# Altium schematic sheet Battery.SchDoc: Battery
size A4; Date: 2016/01/04; Author: Samuel López; DocumentNumber: 3; SheetNumber: 3; SheetTotal: 7; Project: H2H Main Board
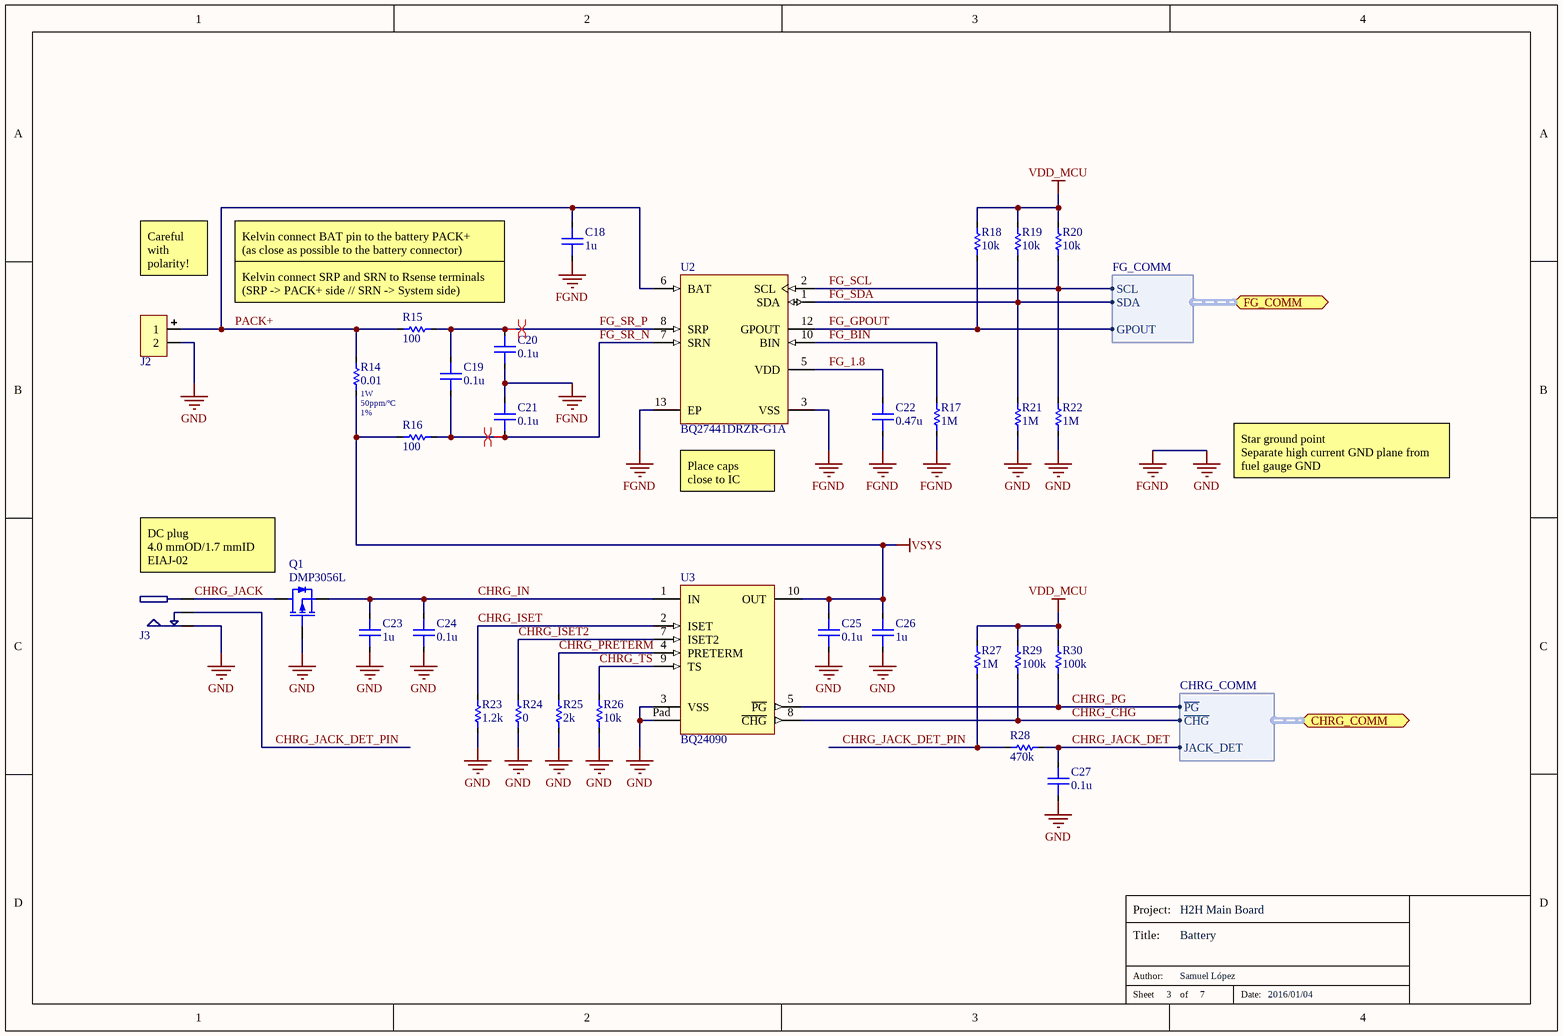
[diagram p0: Battery.SchDoc]

## Parts
C18  1u  [C0603]
C19  0.1u  [C0603]
C20  0.1u  [C0603]
C21  0.1u  [C0603]
C22  0.47u  [C0603]
C23  1u  [C0603]
C24  0.1u  [C0603]
C25  0.1u  [C0603]
C26  1u  [C0603]
C27  0.1u  [C0603]
J2  JST PH 2 Pin  [S2B-PH-K-S]  (value not drawn)
J3  PJ-018H-SMT  [PJ-018H-SMT]  (value not drawn)
Q1  DMP3056L  [DMP3056L]
R14  0.01  Power: 1W  Tolerance: 1%  Temp. coef.: 50ppm/ºC  [R1206]
R15  100  [R0603]
R16  100  [R0603]
R17  1M  [R0603]
R18  10k  [R0603]
R19  10k  [R0603]
R20  10k  [R0603]
R21  1M  [R0603]
R22  1M  [R0603]
R23  1.2k  [R0603]
R24  0  [R0603]
R25  2k  [R0603]
R26  10k  [R0603]
R27  1M  [R0603]
R28  470k  [R0603]
R29  100k  [R0603]
R30  100k  [R0603]
U2  BQ27441DRZR-G1A  [BQ27441DRZx-G1A]
U3  BQ24090  [BQ24090]

## Ports
CHRG_COMM (harness CHRG_COMM), FG_COMM (harness FG_COMM)

## Harnesses
FG_COMM: SCL, SDA, GPOUT
CHRG_COMM: ~{PG}, ~{CHG}, JACK_DET

## Nets
FGND: C18.1 C20.1 C21.2 C22.1 C23.1 C24.1 C25.1 C26.1 C27.1 J2.2 J3.2 Q1.1(G) R17.2 R21.2 R22.2 R23.2 R24.2 R25.2 R26.2 U2.3(VSS) U2.13(EP) U3.3(VSS) U3.Pad(Thermal)  [also labelled GND]
VDD_MCU: R18.1 R19.1 R20.1 R27.1 R29.1 R30.1
VSYS: C25.2 C26.2 R14.2 R16.1 U3.10(OUT)
CHRG_CHG: R29.2 U3.8(~{CHG}) ; port CHRG_COMM.~{CHG}
CHRG_IN: C23.2 C24.2 Q1.2(S) U3.1(IN)
CHRG_ISET: R23.1 U3.2(ISET)
CHRG_ISET2: R24.1 U3.7(ISET2)
CHRG_JACK: J3.1 Q1.3(D)
CHRG_JACK_DET: C27.2 R28.1 ; port CHRG_COMM.JACK_DET
CHRG_JACK_DET_PIN: J3.3 R27.2 R28.2
CHRG_PG: R30.2 U3.5(~{PG}) ; port CHRG_COMM.~{PG}
CHRG_PRETERM: R25.1 U3.4(PRETERM)
CHRG_TS: R26.1 U3.9(TS)
FG_1.8: C22.2 U2.5(VDD)
FG_BIN: R17.1 U2.10(BIN)
FG_GPOUT: R18.2 U2.12(GPOUT) ; port FG_COMM.GPOUT
FG_SCL: R20.2 R22.1 U2.2(SCL) ; port FG_COMM.SCL
FG_SDA: R19.2 R21.1 U2.1(SDA) ; port FG_COMM.SDA
FG_SR_N: C19.1 C21.1 R16.2 U2.7(SRN)
FG_SR_P: C19.2 C20.2 R15.2 U2.8(SRP)
PACK+: C18.2 J2.1 R14.1 R15.1 U2.6(BAT)

## Layout directives
differential pair: FG_SR_N, FG_SR_P

## Notes on the sheet
- Careful with
  polarity!
- Kelvin connect BAT pin to the battery PACK+
  (as close as possible to the battery connector)
- Kelvin connect SRP and SRN to Rsense terminals
  (SRP -> PACK+ side // SRN -> System side)
- (near U2) Place caps
  close to IC
- Star ground point
  Separate high current GND plane from
  fuel gauge GND
- DC plug
  4.0 mmOD/1.7 mmID
  EIAJ-02
- Project:
- Title:
- Sheet
- Author:
- of
- Date:

## Library data of the parts
C18-C27 = Capacitor: Rated Voltage: *
  C18 C23 C26: Value: 1u
  C19-C21 C24 C25 C27: Value: 0.1u
  C22: Value: 0.47u
J2 = S2B-PH-K-S: Conn - Battery, Male, 2 Pin, PCB, Right Angle; Supplier 1: Digi-Key; Supplier Part Number 1: 455-1719-ND
J3 = PJ-018H-SMT: Conn - DC Power Plug - 4.0 mmOD / 1.7 mmID; Inner Diameter: 1.7 mm; Outer Diameter: 4.0 mm; DC Conn Standard: EIAJ-02; Supplier 1: Digi-Key; Supplier Part Number 1: CP-018HPJCT-ND
Q1 = DMP3056L: Transistor - MOSFET, P-Channel, 30V, 4.3A; RDSon @ VGS =-4.5V: 50 m; Supplier 1: Digi-Key; Supplier Part Number 1: DMP3056L-7DICT-ND
R14-R30 = Resistor
  R14: Value: 0.01; Supplier 1: Digi-Key; Supplier Part Number 1: MCS1632R010FERCT-ND
  R15 R16: Value: 100; Power: *
  R17 R21 R22 R27: Value: 1M; Power: *
  R18-R20 R26: Value: 10k; Power: *
  R23: Value: 1.2k; Power: *
  R24: Value: 0; Power: *
  R25: Value: 2k; Power: *
  R28: Value: 470k; Power: *
  R29 R30: Value: 100k; Power: *
U2 = BQ27441DRZR-G1A: IC - Fuel Gauge, System-Side Impedance Track; PartNumber: BQ27410DRZR-G1A; Manufacturer: Texas Instruments; Eco-Plan: Green (RoHS & no Sb/Br); Lead Acid: N; Li-Ion: Y; SubFamily: Battery Fuel Gauge; DatasheetVersion: SLUSAF4; PackageVersion: revB, Apr-2006; PackageReference: DRZ12-1950X2450TP; PackageDescription: 12-Pin Plastic Small Outline No-Lead, 4 x 2.5 x 1 mm Body, 0.4 mm Pitch, Exposed Pad, Pb-Free; Li-Polymer: Y; NiCd: N; NiMH: N; Over Voltage Protection: N; Mounting Technology: Surface Mount; ComponentLink1Description: Datasheet; ComponentLink1URL: http://www.ti.com/general/docs/lit/getliterature.tsp?genericPartNumber=BQ27410-G1&fileType=pdf; Supplier 1: Digi-Key; Supplier Part Number 1: 296-39941-1-ND
U3 = BQ24090: IC - Battery Charger, Single Cell Li-Ion/LiPo, 1A; Supplier 1: Digi-Key; Supplier Part Number 1: 296-38875-1-ND